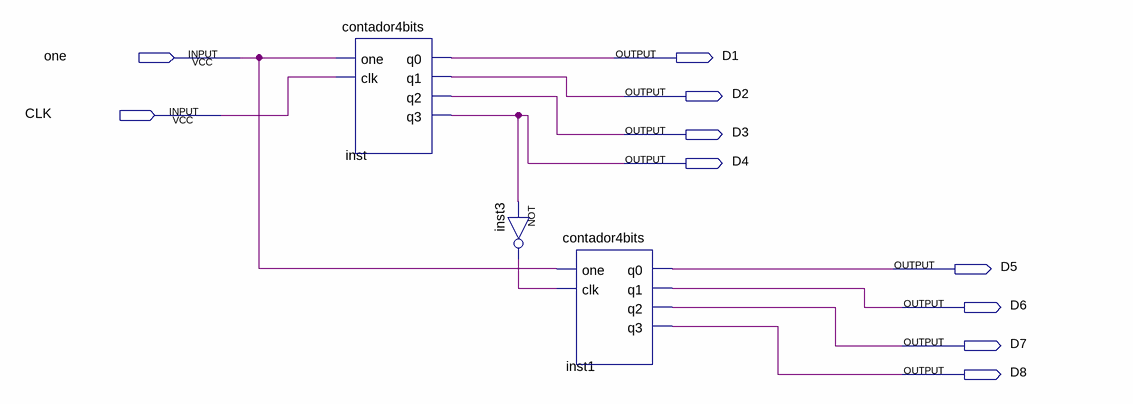
[diagram p0: schematic sheet]
// Quartus schematic contador8bits.bdf as structural Verilog: 3 symbols, 10 pins
module contador8bits (
  input  one,
  input  CLK,
  output D1,
  output D2,
  output D3,
  output D4,
  output D5,
  output D6,
  output D7,
  output D8
);

  wire inst3_out;

  contador4bits inst (.one(one), .clk(CLK), .q0(D1), .q1(D2), .q2(D3), .q3(D4));
  not inst3 (inst3_out, D4);
  contador4bits inst1 (.one(one), .clk(inst3_out), .q0(D5), .q1(D6), .q2(D7), .q3(D8));
endmodule
